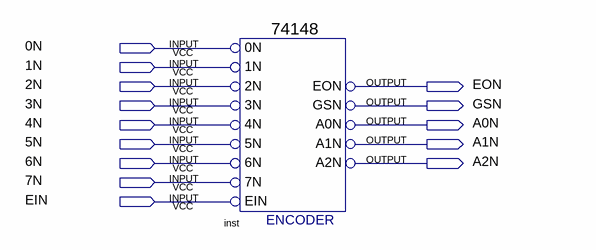
[diagram p0: schematic sheet]
// Quartus schematic 6.bdf as structural Verilog: 1 symbols, 14 pins
module \6  (
  input  \0N ,
  input  \1N ,
  input  \2N ,
  input  \3N ,
  input  \4N ,
  input  \5N ,
  input  \6N ,
  input  \7N ,
  input  EIN,
  output EON,
  output GSN,
  output A0N,
  output A1N,
  output A2N
);

  \74148  inst (
    .\5N (\5N ), .\0N (\0N ), .\1N (\1N ), .\2N (\2N ), .\3N (\3N ), .\4N (\4N ), .EIN(EIN), .\6N (\6N ),
    .\7N (\7N ), .A1N(A1N), .A0N(A0N), .A2N(A2N), .EON(EON), .GSN(GSN));
endmodule
